# EAGLE design amplifier ckt (EAGLE 6.5.0)
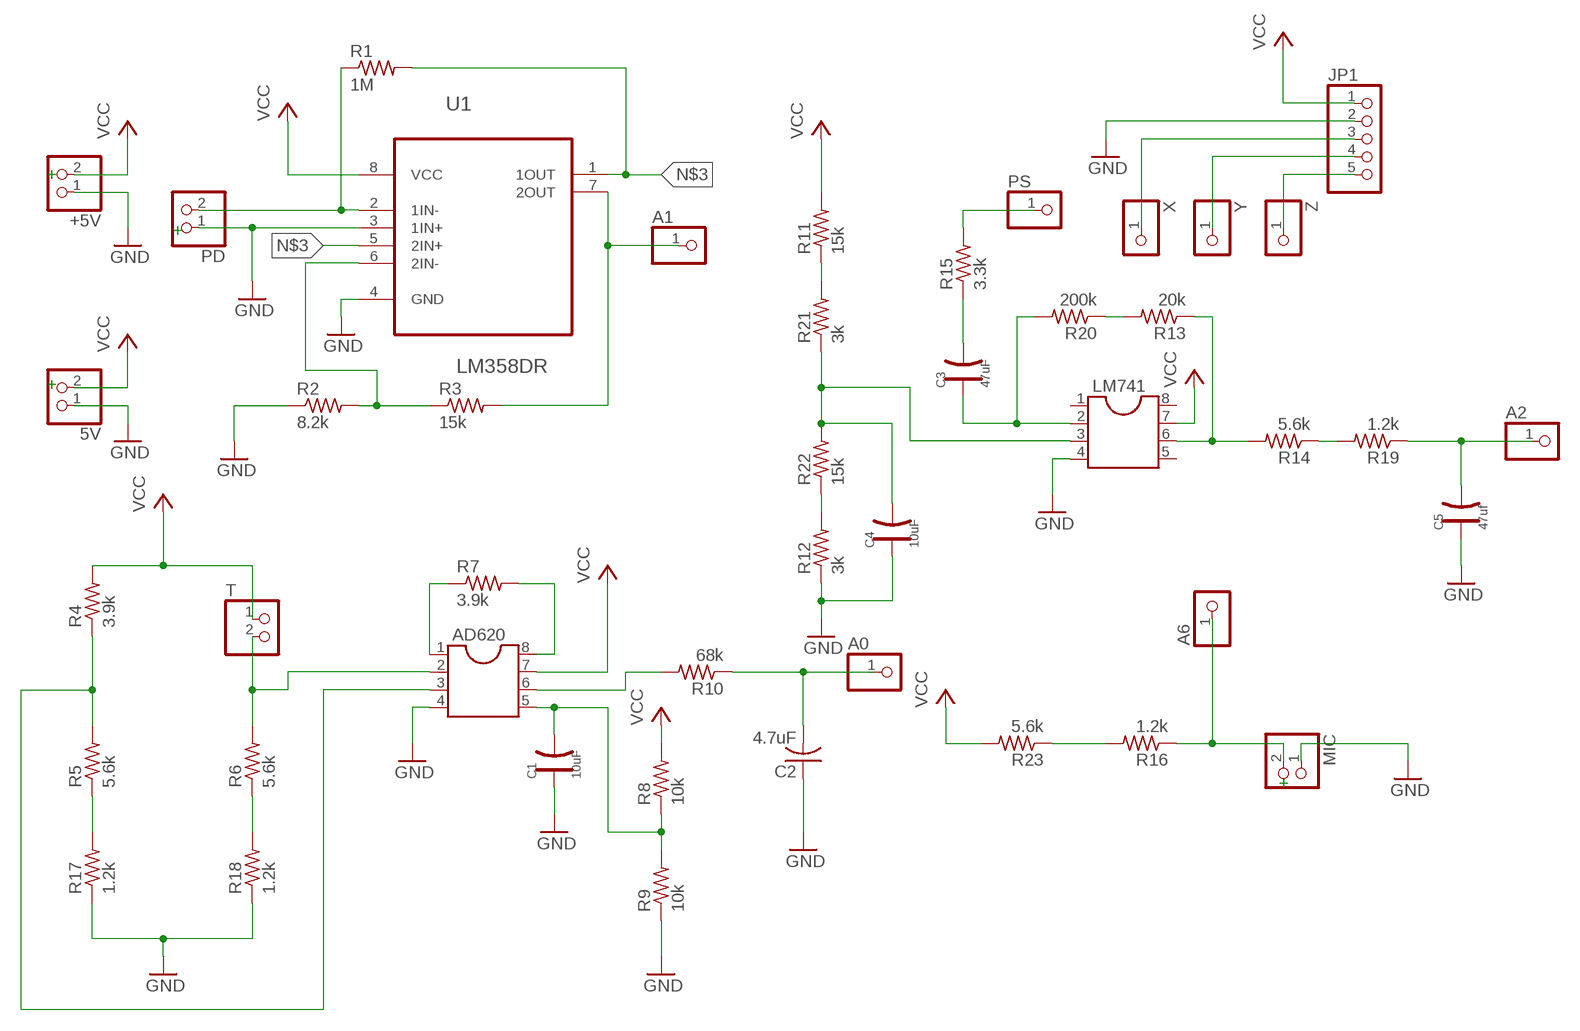
[diagram p0: schematic, sheet 1]

## Parts
5V  PINHD-1X2  [1X02]
+5V  PINHD-1X2  [1X02]
A0  PINHD-1X1  [1X01]
A1  PINHD-1X1  [1X01]
A2  PINHD-1X1  [1X01]
A6  PINHD-1X1  [1X01]
AD620  DIL8S  [SOCKET-08]
C1  10uF  CAP-POLAR-AVX-B  [AVX-B]
C2  4.7uF  C-USC0805  [C0805]
C3  47uF  CAP-POLAR-AVX-B  [AVX-B]
C4  10uF  CAP-POLAR-AVX-B  [AVX-B]
C5  47uf  CAP-POLAR-AVX-B  [AVX-B]
JP1  PINHD-1X5  [1X05]
LM741  DIL8S  [SOCKET-08]
MIC  PINHD-1X2  [1X02]
PD  PINHD-1X2  [1X02]
PS  PINHD-1X1  [1X01]
R1  1M  R-US_R0603  [R0603]
R2  8.2k  R-US_R0603  [R0603]
R3  15k  R-US_R0603  [R0603]
R4  3.9k  R-US_R0603  [R0603]
R5  5.6k  R-US_R0603  [R0603]
R6  5.6k  R-US_R0603  [R0603]
R7  3.9k  R-US_R0603  [R0603]
R8  10k  R-US_R0603  [R0603]
R9  10k  R-US_R0603  [R0603]
R10  68k  R-US_R0603  [R0603]
R11  15k  R-US_R0603  [R0603]
R12  3k  R-US_R0603  [R0603]
R13  20k  R-US_R0603  [R0603]
R14  5.6k  R-US_R0603  [R0603]
R15  3.3k  R-US_R0603  [R0603]
R16  1.2k  R-US_R0603  [R0603]
R17  1.2k  R-US_R0603  [R0603]
R18  1.2k  R-US_R0603  [R0603]
R19  1.2k  R-US_R0603  [R0603]
R20  200k  R-US_R0603  [R0603]
R21  3k  R-US_R0603  [R0603]
R22  15k  R-US_R0603  [R0603]
R23  5.6k  R-US_R0603  [R0603]
T  PINHD-1X2  [1X02]
U1  LM358DR  [SOIC127P600X175-8N]
X  PINHD-1X1  [1X01]
Y  PINHD-1X1  [1X01]
Z  PINHD-1X1  [1X01]

## Nets
GND: 5V.1 +5V.1 AD620.4 C1.+ C2.1 C4.+ C5.+ JP1.2 LM741.4 MIC.1 PD.1 R2.1 R9.1 R12.1 R17.1 R18.1 U1.3(1IN+) U1.4(GND)
N$1: PD.2 R1.1 U1.2(1IN-)
N$2: AD620.5 C1.- R8.1 R9.2
N$3: R1.2 U1.1(1OUT) U1.5(2IN+)
N$4: A1.1 R3.2 U1.7(2OUT)
N$5: R2.2 R3.1 U1.6(2IN-)
N$6: AD620.2 R6.2 T.2
N$7: R14.1 R19.2
N$8: AD620.3 R4.1 R5.2
N$9: AD620.1 R7.1
N$10: AD620.8 R7.2
N$11: AD620.6 R10.2
N$12: A0.1 C2.2 R10.1
N$13: C4.- LM741.3 R21.1 R22.2
N$14: PS.1 R15.2
N$15: C3.- R15.1
N$16: C3.+ LM741.2 R20.2
N$17: LM741.6 R13.1 R14.2
N$18: A2.1 C5.- R19.1
N$19: A6.1 MIC.2 R16.1
N$20: R5.1 R17.2
N$21: R6.1 R18.2
N$22: R13.2 R20.1
N$23: R16.2 R23.1
N$24: R11.1 R21.2
N$25: R12.2 R22.1
N$26: JP1.3 X.1
N$27: JP1.4 Y.1
N$28: JP1.5 Z.1
VCC: 5V.2 +5V.2 AD620.7 JP1.1 LM741.7 R4.2 R8.2 R11.2 R23.2 T.1 U1.8(VCC)
Unconnected: LM741.1 LM741.5 LM741.8

## Notes on the sheet
- +
- +
- +
- +

## Library data of the parts
5V +5V MIC PD T = pinhead:PINHD-1X2: PIN HEADER
A0 A1 A2 A6 PS X Y Z = pinhead:PINHD-1X1: PIN HEADER
AD620 LM741 = ic-package:DIL8: Dual In Line / Socket
C1 C3-C5 = OPL:CAP-POLAR: Electrolytic Capacitors,Tantalum Capacitors and Super Capacitors
C2 = rcl:C-US: CAPACITOR, American symbol
JP1 = pinhead:PINHD-1X5: PIN HEADER
R1-R23 = rcl:R-US_: RESISTOR, American symbol
U1 = Texas Instruments_By_element14_Batch_1:LM358DR: OPERATIONAL AMPLIFIERS; MPN: LM358DR; OC_FARNELL: 1831865; OC_NEWARK: 34K7599; PACKAGE: SOIC-8; SUPPLIER: Texas Instruments

## Net classes
0 default: width 0.254 mm, drill 0.508 mm, clearance 0.254 mm

## Board
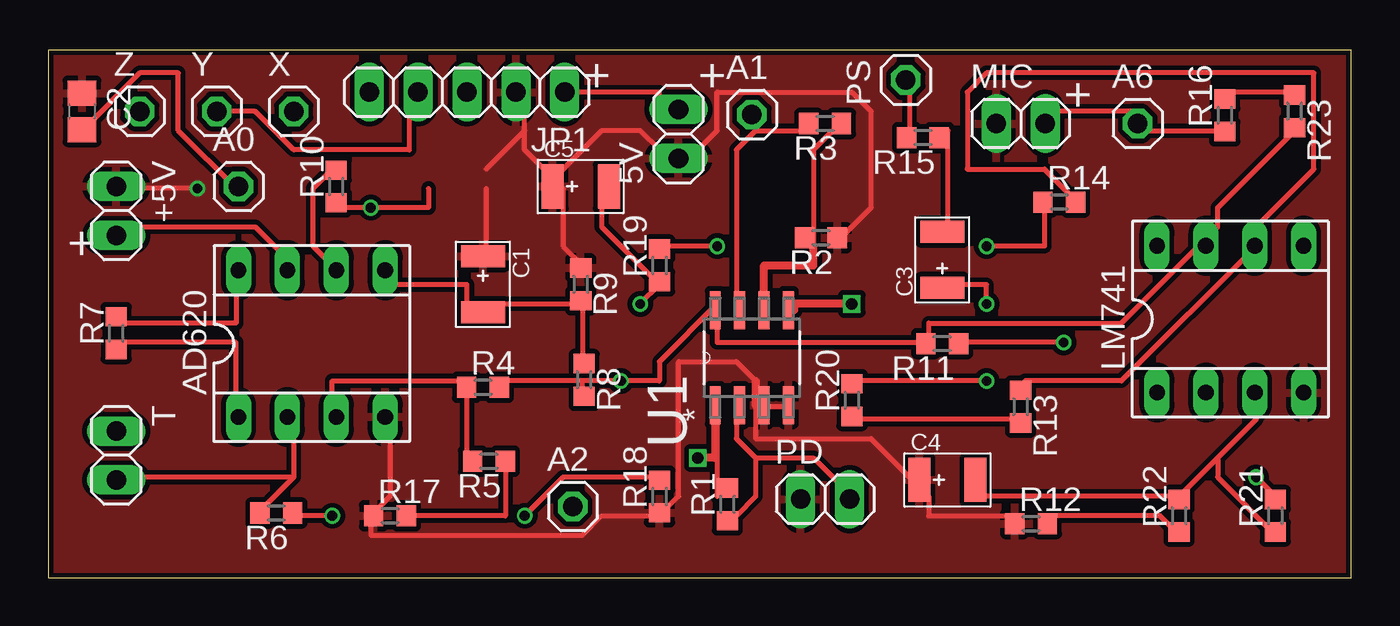
[diagram p1: board, top side]
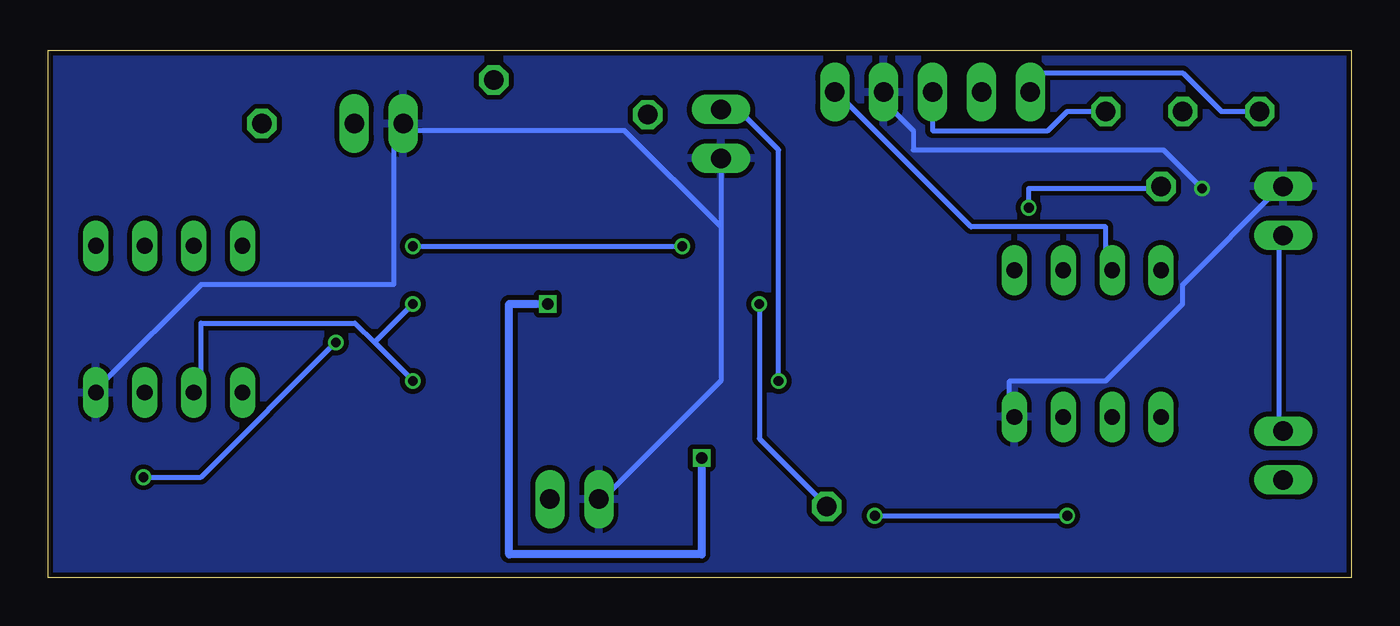
[diagram p2: board, bottom side, seen from below]

Size 67.71 x 27.39 mm. Coordinates in mm from the lower left corner, seen from the top.
Outline: 0,0 67.71,0 67.71,27.39 0,27.39 0,0
Copper layers (1*16): Top 0.035mm / dielectric 1.5mm / Bottom 0.035mm
Design rules "SeeedStudio_2layer_DRU_no_angle_20140221": minimum track width 6mil, minimum drill 12mil, track to track 6mil, track to pad 6mil, pad to pad 6mil, via to via 6mil, smd to smd 0mil, copper to edge 10mil, drill to drill 10mil, minimum pad ring 10mil, minimum via ring 6mil, stop-mask expansion 2mil, vias tented up to drill 100mil, thermal gap 10mil

### Footprints (pad centres in the part's own frame; a part is rotated, then mirrored left to right if it is on the bottom)
1X02 = drill 1.016 long: 1 -1.27,0; 2 1.27,0
1X01 = drill 1.016 octagon: 1 0,0
SOCKET-08 = drill 0.813 long: 1 -3.81,-3.81; 2 -1.27,-3.81; 3 1.27,-3.81; 4 3.81,-3.81; 5 3.81,3.81; 6 1.27,3.81; 7 -1.27,3.81; 8 -3.81,3.81
AVX-B = smd 1.143 x 2.286: + -1.46,0; - 1.46,0
C0805 = smd 1.3 x 1.5: 1 -0.95,0; 2 0.95,0
1X05 = drill 1.016 long: 1 -5.08,0; 2 -2.54,0; 3 0,0; 4 2.54,0; 5 5.08,0
R0603 = smd 1 x 1.1: 1 -0.85,0; 2 0.85,0
SOIC127P600X175-8N = smd 1.981 x 0.559: 1 -2.464,1.905; 2 -2.464,0.635; 3 -2.464,-0.635; 4 -2.464,-1.905; 5 2.464,-1.905; 6 2.464,-0.635; 7 2.464,0.635; 8 2.464,1.905

### Placement (x,y rotation side)
5V  32.75,23.05 90 top
+5V  3.54,19.05 270 top
A0  9.89,20.32 0 top
A1  36.56,24.05 0 top
A2  27.26,3.7 0 top
A6  56.61,23.59 0 top
AD620  13.7,12.16 0 top
C1  22.59,15.24 270 top
C2  1.76,24.22 270 top
C3  46.45,16.51 90 top
C4  46.72,5.08 0 top
C5  27.67,20.32 0 top
JP1  21.76,25.22 180 top
LM741  61.42,13.43 0 top
MIC  50.53,23.59 0 top
PD  40.37,4.08 0 top
PS  44.56,25.86 90 top
R1  35.29,3.81 90 top
R2  40.15,17.66 180 top
R3  40.37,23.59 180 top
R4  22.59,9.89 0 top
R5  22.9,6.05 180 top
R6  11.85,3.36 180 top
R7  3.54,12.7 90 top
R8  27.85,10.28 270 top
R9  27.67,15.24 270 top
R10  14.97,20.32 90 top
R11  46.45,12.16 180 top
R12  51.07,2.81 0 top
R13  50.53,8.89 270 top
R14  52.53,19.51 0 top
R15  45.45,22.86 180 top
R16  61.13,24.02 90 top
R17  17.76,3.22 0 top
R18  31.76,4.22 90 top
R19  31.76,16.22 90 top
R20  41.76,9.22 90 top
R21  63.76,3.22 90 top
R22  58.76,3.22 90 top
R23  64.76,24.22 270 top
T  3.54,6.35 270 top
U1  36.56,11.43 90 top
X  12.76,24.22 0 top
Y  8.76,24.22 0 top
Z  4.76,24.22 0 top

### Tracks (layer width: path | path; a pad name or v marks a point on that pad's centre or on a via)
GND  (via drill 0.51)
  Top 0.254: U1.3 37.32,8.89 38.34,8.89 U1.4 | R12.1 49.76,3.22 45.76,3.22 45.76,4.22 C4.+ 44.76,5.22 42.76,7.22 36.76,7.22 36.76,10.22 35.76,11.22 32.76,11.22 32.76,4.22 31.76,3.22 | 16.76,3.22 17.76,4.22 17.76,8.22 AD620.4 | 31.76,3.22 28.76,3.22 27.76,2.22 16.76,2.22 16.76,3.22 | 16.76,3.22 R17.1 | 31.76,3.22 R18.1 | 22.76,20.22 22.76,17.22 C1.+ | R9.1 27.76,16.22 26.76,17.22 26.76,20.22 C5.+ | 24.76,23.22 24.76,22.22 25.76,21.22 C5.+ | 24.76,23.22 24.76,25.22 JP1.2 | 24.76,23.22 22.76,21.22 | R2.1 40.76,17.22 42.76,19.22 42.76,24.22 41.76,25.22 34.76,25.22 34.76,23.22 32.76,21.22 5V.1 31.76,22.22 30.76,23.22 28.76,23.22 26.76,21.22 C5.+ | v7.76,20.22 3.76,20.22 +5V.1
  Top 0.406: 36.76,10.22 36.76,8.97 U1.3
  Bottom 0.254: +5V.1 3.76,20.22 8.76,15.22 8.76,14.22 12.76,10.22 17.76,10.22 17.76,9.22 AD620.4 | LM741.4 64.76,10.22 59.76,15.22 49.76,15.22 49.76,23.22 MIC.1 48.76,23.22 37.76,23.22 32.76,18.22 | 32.76,18.22 32.76,21.22 5V.1 | 32.76,18.22 32.76,10.22 38.76,4.22 PD.1 | v7.76,20.22 9.76,22.22 22.76,22.22 22.76,23.22 23.76,24.22 23.76,25.22 JP1.2
  pour Top: -0.24,28.22 -1.24,28.22 -1.24,0.22 68.76,0.22 68.76,28.22
  pour Bottom: -1.24,28.22 -1.24,-0.78 68.76,-0.78 68.76,29.22 -1.24,29.22
N$1
  Top 0.254: 36.76,6.22 36.76,4.22 35.76,3.22 R1.1 | 36.76,6.22 35.76,7.22 35.76,8.22 U1.2 | 36.76,6.22 39.76,6.22 41.76,4.22 PD.2
N$2
  Top 0.254: 27.76,14.22 27.76,11.22 R8.1 | 27.76,14.22 22.76,14.22 C1.- 21.76,14.22 21.76,15.22 17.76,15.22 AD620.5 | 27.76,14.22 R9.2
N$3  (via drill 0.6)
  Top 0.254: R1.2 34.76,4.22 34.76,8.22 U1.1
  Top 0.406: U1.1 34.66,6.22 v33.76,6.22 | v41.76,14.22 38.76,14.22 38.76,13.89 U1.5
  Bottom 0.406: v33.76,6.22 33.76,1.22 43.76,1.22 43.76,14.22 v41.76,14.22
N$4
  Top 0.254: 36.76,23.22 39.76,23.22 R3.2 | 36.76,23.22 36.76,24.22 A1.1 | 36.76,23.22 35.76,22.22 35.76,14.22 U1.7
N$5
  Top 0.254: R2.2 39.76,17.22 39.76,22.22 40.76,23.22 R3.1
  Top 0.406: U1.6 37.2,16.22 39.76,16.22 39.76,17.22
N$6
  Top 0.254: 12.76,5.22 10.76,3.22 R6.2 | 12.76,5.22 12.76,8.22 AD620.2 | 12.76,5.22 3.76,5.22 T.2
N$7  (via drill 0.51)
  Top 0.254: v34.76,17.22 31.76,17.22 R19.2 | v48.76,17.22 51.76,17.22 51.76,19.22 R14.1
  Bottom 0.254: v48.76,17.22 v34.76,17.22
N$8
  Top 0.254: 21.76,10.22 21.76,6.22 R5.2 | 21.76,10.22 14.76,10.22 14.76,9.22 AD620.3 | 21.76,10.22 R4.1
N$9
  Top 0.254: R7.1 3.76,12.22 9.76,12.22 9.76,9.22 AD620.1
N$10
  Top 0.254: R7.2 3.76,13.22 9.76,13.22 9.76,15.22 AD620.8
N$11
  Top 0.254: R10.2 14.76,21.22 13.76,20.22 13.76,17.22 14.76,16.22 AD620.6
N$12  (via drill 0.51)
  Top 0.254: 19.76,20.22 19.76,19.22 v16.76,19.22 14.76,19.22 R10.1 | C2.2 1.76,23.22 4.76,26.22 6.76,26.22 6.76,23.22 9.76,20.22 A0.1
  Bottom 0.254: v16.76,19.22 16.76,20.22 9.76,20.22 A0.1
N$13
  Top 0.254: 60.76,6.22 62.76,8.22 62.76,9.22 LM741.3 | 60.76,6.22 58.76,4.22 | 60.76,6.22 60.76,5.22 63.76,2.22 R21.1 | 58.76,4.22 47.76,4.22 C4.- | 58.76,4.22 R22.2
N$14
  Top 0.254: R15.2 44.76,23.22 44.76,25.22 PS.1
N$15
  Top 0.254: R15.1 46.76,23.22 46.76,18.22 C3.-
N$16  (via drill 0.51)
  Top 0.254: v48.76,10.22 41.76,10.22 R20.2 | v48.76,14.22 48.76,15.22 46.76,15.22 C3.+
  Bottom 0.254: 50.76,12.22 51.76,13.22 59.76,13.22 59.76,10.22 LM741.2 | 50.76,12.22 v48.76,10.22 | 50.76,12.22 v48.76,14.22
N$17
  Top 0.254: R13.1 50.76,10.22 55.76,10.22 62.76,17.22 LM741.6 62.76,18.22 65.76,21.22 65.76,26.22 48.76,26.22 47.76,25.22 47.76,21.22 51.76,21.22 53.76,19.22 R14.2
N$18  (via drill 0.51)
  Top 0.254: 31.76,15.22 28.76,18.22 28.76,20.22 C5.- | 31.76,15.22 v30.76,14.22 | 31.76,15.22 R19.1
  Bottom 0.254: v30.76,14.22 30.76,7.22 27.76,4.22 A2.1
N$19
  Top 0.254: R16.1 60.76,23.22 56.76,23.22 A6.1 56.76,24.22 51.76,24.22 MIC.2
N$20
  Top 0.254: R17.2 23.76,3.22 23.76,6.22 R5.1
N$21  (via drill 0.51)
  Top 0.254: v14.76,3.22 12.76,3.22 R6.1 | v24.76,3.22 26.76,5.22 31.76,5.22 R18.2
  Bottom 0.254: v24.76,3.22 v14.76,3.22
N$22
  Top 0.254: R20.1 41.76,8.22 50.76,8.22 R13.2
N$23
  Top 0.254: R16.2 60.76,25.22 64.76,25.22 R23.1
N$24  (via drill 0.51)
  Top 0.254: v52.76,12.22 47.76,12.22 R11.1 | v62.76,5.22 63.76,4.22 R21.2
  Bottom 0.254: v52.76,12.22 59.76,5.22 v62.76,5.22
N$25
  Top 0.254: R12.2 51.76,3.22 57.76,3.22 58.76,2.22 R22.1
N$26
  Bottom 0.254: X.1 14.76,24.22 15.76,23.22 21.76,23.22 JP1.3
N$27
  Top 0.254: Y.1 10.76,24.22 12.76,22.22 18.76,22.22 18.76,25.22 JP1.4
N$28
  Bottom 0.254: Z.1 6.76,24.22 8.76,26.22 16.76,26.22 16.76,25.22 JP1.5
VCC  (via drill 0.51)
  Top 0.254: 26.76,25.22 JP1.1 31.76,25.22 31.76,24.22 5V.2 | AD620.7 12.76,16.22 10.76,18.22 3.76,18.22 +5V.2 | R23.2 64.76,23.22 60.76,19.22 60.76,18.22 LM741.7 59.76,17.22 55.76,13.22 45.76,13.22 45.76,12.22 | 27.76,10.22 23.76,10.22 R4.2 | 27.76,10.22 27.76,9.22 R8.2 | 45.76,12.22 34.76,12.22 34.76,13.22 U1.8 34.76,14.22 31.76,11.22 31.76,10.22 v29.76,10.22 27.76,10.22 | 45.76,12.22 R11.2
  Bottom 0.254: T.1 3.76,8.22 3.76,17.22 +5V.2 | JP1.1 26.76,25.22 19.76,18.22 12.76,18.22 12.76,16.22 AD620.7 | v29.76,10.22 29.76,22.22 31.76,24.22 5V.2

### Text on the board
tNames: + | + | + | +